# Altium schematic sheet Current_Measurement.SchDoc: Current Measurement
size A4; Revision: 1.0; SheetNumber: 9; SheetTotal: 11; Class: B
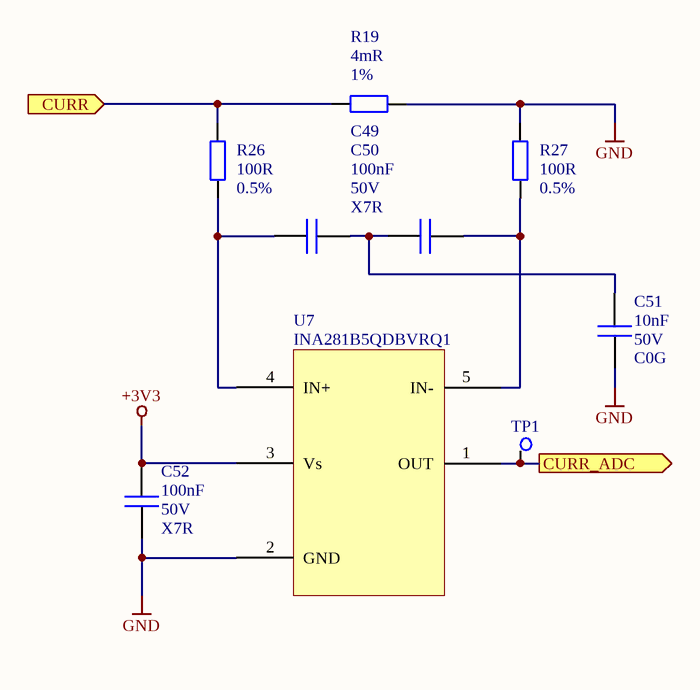
[diagram p0: Current_Measurement.SchDoc]

## Parts
C49  value 100nF  Voltage: 50V  Dielectric: X7R  [C_0603]  (hidden comment: C)
C50  C  [C_0603]  (value not drawn)
C51  value 10nF  Voltage: 50V  Dielectric: C0G  [C_0603]  (hidden comment: C)
C52  value 100nF  Voltage: 50V  Dielectric: X7R  [C_0603]  (hidden comment: C)
R19  value 4mR  Tolerance: 1%  [R_1206]  (hidden comment: R)
R26  value 100R  Tolerance: 0.5%  [R_0402]  (hidden comment: R)
R27  value 100R  Tolerance: 0.5%  [R_0402]  (hidden comment: R)
TP1  TP_TestPoint  [TP_01]  (value not drawn)
U7  value INA281B5QDBVRQ1  [SOT_23_5]  (hidden comment: IC_INA281B_Q1)

## Ports
CURR (in), CURR_ADC (out)

## Nets
+3V3: C52.1 U7.3(Vs)
GND: C51.2 C52.2 R19.2 R27.1 U7.2(GND)
CURR: R19.1 R26.1 ; port CURR
CURR_ADC: TP1.1 U7.1(OUT) ; port CURR_ADC
NetC49_1: C49.1 R26.2 U7.4(IN+)
NetC49_2: C49.2 C50.1 C51.1
NetC50_2: C50.2 R27.2 U7.5(IN-)

## Notes on the sheet
- Title:
- Date:
- Revision:
- Class:
- Sheet
- of

## Library data of the parts
C49 C52 = C_100nF_50V_0603: Capacitor; Manufacturer: Kemet; Manufacturer Part Number: C0603T104K5RCL7136; Tmax: 125; Tmin: -55; Grade: 2; Fail Rate: A; Tolerance: 10%; Part Number: C_100nF_50V_0603; HelpURL: https://content.kemet.com/datasheets/KEM_C1027_X7R_COTS_SMD.pdf; Supplier 1: Digi-Key; Supplier Part Number 1: 399-6305-1-ND; Status: Active
C50 = C_100nF_50V_0603: Capacitor; Manufacturer: Kemet; Manufacturer Part Number: C0603T104K5RCL7136; Voltage: 50V; Dielectric: X7R; Value: 100nF; Tmax: 125; Tmin: -55; Grade: 2; Fail Rate: A; Tolerance: 10%; Part Number: C_100nF_50V_0603; HelpURL: https://content.kemet.com/datasheets/KEM_C1027_X7R_COTS_SMD.pdf; Supplier 1: Digi-Key; Supplier Part Number 1: 399-6305-1-ND; Status: Active
C51 = C_10nF_50V_0603: Capacitor; Manufacturer: Kemet; Manufacturer Part Number: C0603T103J5RAC7867; Tmax: 125; Tmin: -55; Grade: 2; Fail Rate: A; Tolerance: 5%; Part Number: C_10nF_50V_0603; HelpURL: https://content.kemet.com/datasheets/KEM_C1027_X7R_COTS_SMD.pdf; Supplier 1: Digi-Key; Supplier Part Number 1: 399-20387-1-ND; Status: Active
R19 = R_4mR_NA_1206: Manufacturer: YAGEO; Manufacturer Part Number: PA1206FRE470R004Z; Voltage: NA; RMS Power: 1W; TCR: 50ppm; Tmax: 170; Tmin: -55; Grade: 2; Part Number: R_4mR_NA_1206; HelpURL: https://www.yageo.com/upload/media/product/products/datasheet/rchip/PYu-PA0100_2512_51_RoHS_2.pdf; Supplier 1: Mouser; Supplier Part Number 1: 603-PA1206FRE470R04Z; Status: Active
R26 R27 = R_100R_50V_0402: Manufacturer: Vishay; Manufacturer Part Number: MCS0402PD1000DE500; Voltage: 50V; RMS Power: 0.2W; TCR: 25ppm; Tmax: 175; Tmin: -55; Grade: 2; Part Number: R_100R_50V_0402; HelpURL: https://www.vishay.com/docs/28916/mcxhp.pdf; Supplier 2: Mouser; Supplier Part Number 2: 594-MCS0402PD1000DP5; Supplier 1: Digi-Key; Supplier Part Number 1: 749-1509-1-ND; Status: Active
TP1 = TestPoint1: Manufacturer: Progresja Space; Value: TP; Grade: 3; Part Number: TestPoint1; Status: Active
U7 = INA281B5QDBVRQ1: Current Sense Amplifiers Automotive AEC-Q100, -4-V to 110-V, 1.3-MHz; Manufacturer: TI; Tmax: 125; Tmin: -40; Grade: 2; Part Number: INA281B5QDBVRQ1; HelpURL: https://www.ti.com/lit/ds/symlink/ina281-q1.pdf?ts=1661510274550&ref_url=https%253A%252F%252Fwww.google.com%252F; Manufacturer Part Number: INA281B5QDBVRQ1; Supplier 1: Mouser; Supplier Part Number 1: 595-INA281B5QDBVRQ1; Status: Active